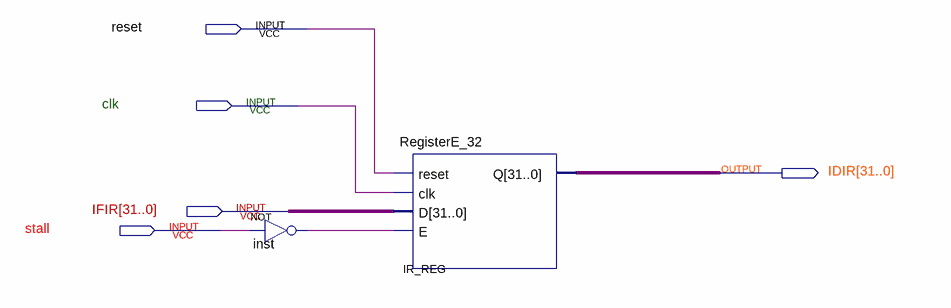
[diagram p0: schematic sheet]
// Quartus schematic IFIDTower.bdf as structural Verilog: 2 symbols, 5 pins
module IFIDTower (
  input  reset,
  input  clk,
  input  [31:0] IFIR,
  input  stall,
  output [31:0] IDIR
);

  wire inst_out;

  not inst (inst_out, stall);
  RegisterE_32 IR_REG (.reset(reset), .clk(clk), .D(IFIR), .E(inst_out), .Q(IDIR));
endmodule
